# Altium project MB1115.PrjPCB
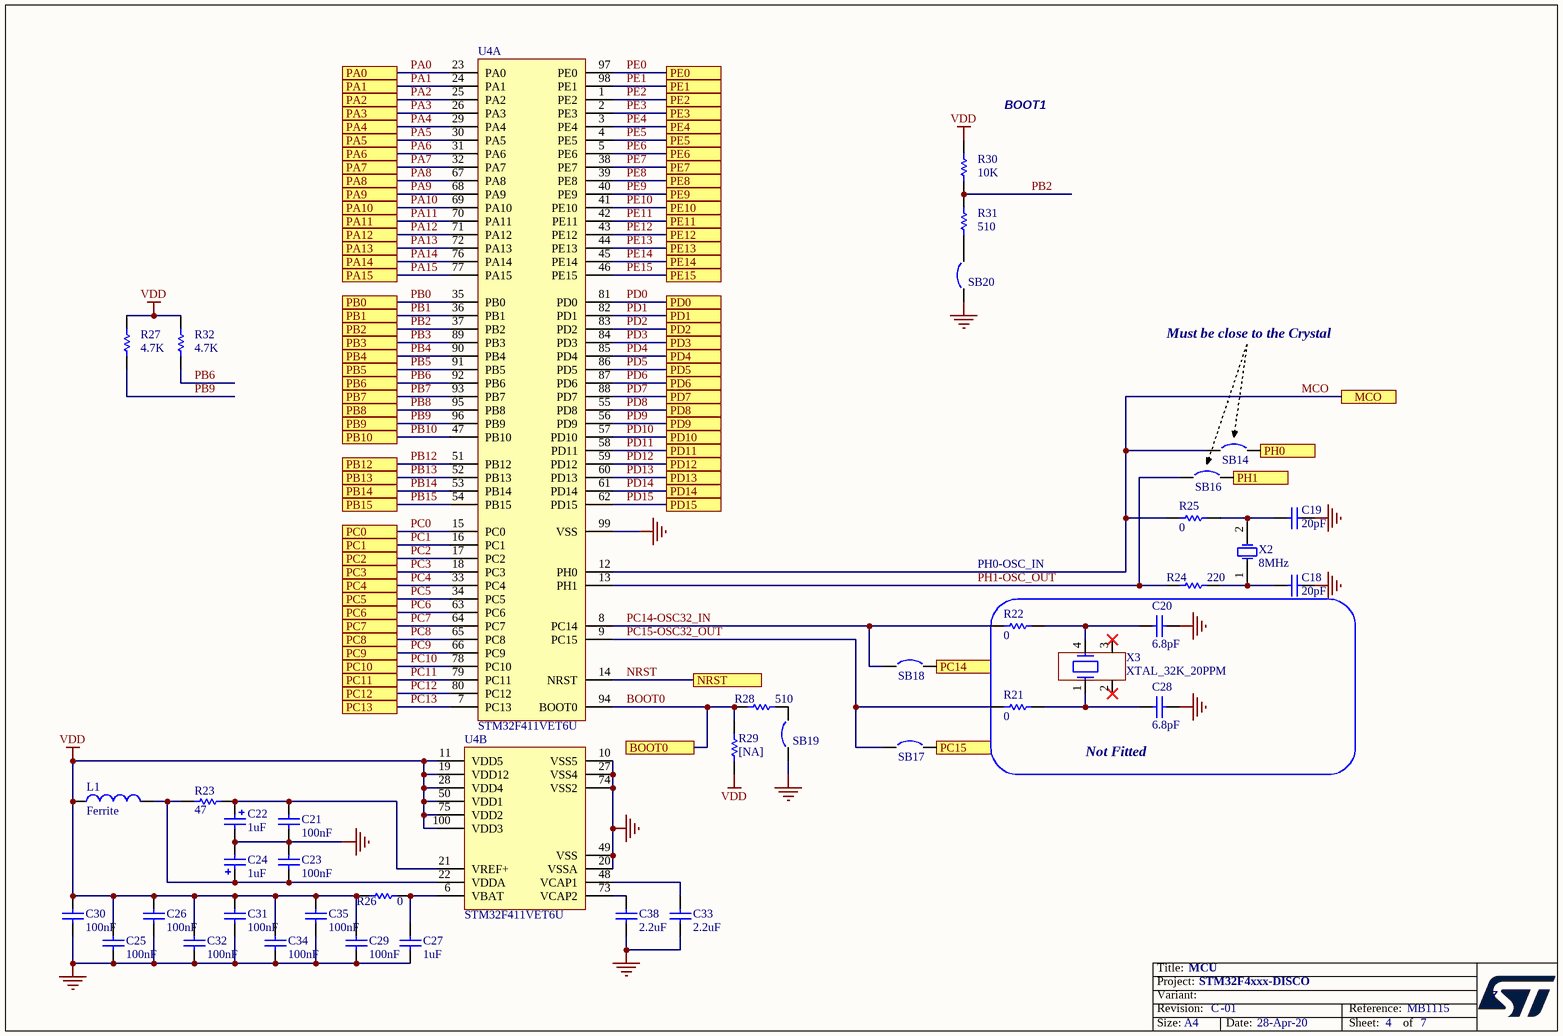
[diagram p0: STM32Fx.SchDoc]
Board_Reference: MB1115; Board_PCB_Revision: C; Board_Name: STM32F4xxx-DISCO; Board_Document_Date: 28-Apr-20; Board_Assembly_Revision: 01
1 sheet, 41 parts. Net scope: flat (ports and power ports of the same name join across sheets).
Board file: MB1115C.PcbDoc

## Sheet STM32Fx.SchDoc: MCU
size A4; DocumentNumber: 3; SheetNumber: 4; SheetTotal: 7

### Parts
C18  20pF  [0402C (Primary)]
C19  20pF  [0402C (Primary)]
C20  6.8pF  [0402C (Primary)]
C21  100nF  [0402C (Primary)]
C22  1uF  [TAN-A (Primary)]
C23  100nF  [0402C (Primary)]
C24  1uF  [TAN-A (Primary)]
C25  100nF  [0402C (Primary)]
C26  100nF  [0402C (Primary)]
C27  1uF  [0603C (Primary)]
C28  6.8pF  [0402C (Primary)]
C29  100nF  [0402C (Primary)]
C30  100nF  [0402C (Primary)]
C31  100nF  [0402C (Primary)]
C32  100nF  [0402C (Primary)]
C33  2.2uF  [TAN-A (Primary)]
C34  100nF  [0402C (Primary)]
C35  100nF  [0402C (Primary)]
C38  2.2uF  [TAN-A (Primary)]
L1  Ferrite  [0603L (Primary)]
R21  0  [0402R (Primary)]
R22  0  [0402R (Primary)]
R23  47  [0402R (Primary)]
R24  220  [0402R (Primary)]
R25  0  [0402R (Primary)]
R26  0  [0402R (Primary)]
R27  4.7K  [0402R (Primary)]
R28  510  [0402R (Primary)]
R29  [NA]  [0402R (Primary)]
R30  10K  [0402R (Primary)]
R31  510  [0402R (Primary)]
R32  4.7K  [0402R (Primary)]
SB14  Circuit Breaker  [JP2_SMD (Primary)]  (value not drawn)
SB16  Circuit Breaker  [JP2_SMD (Primary)]  (value not drawn)
SB17  Circuit Breaker  [JP2_SMD (Primary)]  (value not drawn)
SB18  Circuit Breaker  [JP2_SMD (Primary)]  (value not drawn)
SB19  Circuit Breaker  [JP2_SMD (Primary)]  (value not drawn)
SB20  Circuit Breaker  [JP2_SMD (Primary)]  (value not drawn)
U4  STM32F411VET6U  [TQFP100_14X14 (Primary)]  (parts A,B of 2)
X2  8MHz  [XTAL1 (Primary)]
X3  XTAL_32K_20PPM  [MC306-CRYSTAL (Primary)]

### Blocks framed on the sheet
Not Fitted: C20 C28 R21 R22 X3

### Ports
BOOT0, MCO, NRST, PA0, PA1, PA2, PA3, PA4, PA5, PA6, PA7, PA8, PA9, PA10, PA11, PA12, PA13, PA14, PA15, PB0, PB1, PB2, PB3, PB4, PB5, PB6, PB7, PB8, PB9, PB10, PB12, PB13, PB14, PB15, PC0, PC1, PC2, PC3, PC4, PC5, PC6, PC7, PC8, PC9, PC10, PC11, PC12, PC13, PC14, PC15, PD0, PD1, PD2, PD3, PD4, PD5, PD6, PD7, PD8, PD9, PD10, PD11, PD12, PD13, PD14, PD15, PE0, PE1, PE2, PE3, PE4, PE5, PE6, PE7, PE8, PE9, PE10, PE11, PE12, PE13, PE14, PE15, PH0, PH1

### Nets
GND: C18.1 C19.1 C20.2 C21.1 C22.2 C23.1 C24.2 C25.1 C26.2 C27.2 C28.2 C29.1 C30.1 C31.1 C32.1 C33.2 C34.1 C35.2 C38.2 SB19.1 SB20.1 U4.10(VSS5) U4.20(VSSA) U4.27(VSS4) U4.49(VSS) U4.74(VSS2) U4.99(VSS)
VDD: C25.2 C26.1 C29.2 C30.2 C31.2 C32.2 C34.2 C35.1 L1.1 R26.1 R27.1 R29.1 R30.1 R32.1 U4.11(VDD5) U4.19(VDD12) U4.28(VDD4) U4.50(VDD1) U4.75(VDD2) U4.100(VDD3)
BOOT0: R28.2 R29.2 U4.94(BOOT0) ; port BOOT0
MCO: R25.1 SB14.1 U4.12(PH0) ; port MCO
NRST: U4.14(NRST) ; port NRST
PA0: U4.23(PA0) ; port PA0
PA1: U4.24(PA1) ; port PA1
PA2: U4.25(PA2) ; port PA2
PA3: U4.26(PA3) ; port PA3
PA4: U4.29(PA4) ; port PA4
PA5: U4.30(PA5) ; port PA5
PA6: U4.31(PA6) ; port PA6
PA7: U4.32(PA7) ; port PA7
PA8: U4.67(PA8) ; port PA8
PA9: U4.68(PA9) ; port PA9
PA10: U4.69(PA10) ; port PA10
PA11: U4.70(PA11) ; port PA11
PA12: U4.71(PA12) ; port PA12
PA13: U4.72(PA13) ; port PA13
PA14: U4.76(PA14) ; port PA14
PA15: U4.77(PA15) ; port PA15
PB0: U4.35(PB0) ; port PB0
PB1: U4.36(PB1) ; port PB1
PB2: R30.2 R31.1 U4.37(PB2) ; port PB2
PB3: U4.89(PB3) ; port PB3
PB4: U4.90(PB4) ; port PB4
PB5: U4.91(PB5) ; port PB5
PB6: R32.2 U4.92(PB6) ; port PB6
PB7: U4.93(PB7) ; port PB7
PB8: U4.95(PB8) ; port PB8
PB9: R27.2 U4.96(PB9) ; port PB9
PB10: U4.47(PB10) ; port PB10
PB12: U4.51(PB12) ; port PB12
PB13: U4.52(PB13) ; port PB13
PB14: U4.53(PB14) ; port PB14
PB15: U4.54(PB15) ; port PB15
PC0: U4.15(PC0) ; port PC0
PC1: U4.16(PC1) ; port PC1
PC2: U4.17(PC2) ; port PC2
PC3: U4.18(PC3) ; port PC3
PC4: U4.33(PC4) ; port PC4
PC5: U4.34(PC5) ; port PC5
PC6: U4.63(PC6) ; port PC6
PC7: U4.64(PC7) ; port PC7
PC8: U4.65(PC8) ; port PC8
PC9: U4.66(PC9) ; port PC9
PC10: U4.78(PC10) ; port PC10
PC11: U4.79(PC11) ; port PC11
PC12: U4.80(PC12) ; port PC12
PC13: U4.7(PC13) ; port PC13
PC14-OSC32_IN: R22.1 SB18.1 U4.8(PC14)
PC15-OSC32_OUT: R21.1 SB17.1 U4.9(PC15)
PD0: U4.81(PD0) ; port PD0
PD1: U4.82(PD1) ; port PD1
PD2: U4.83(PD2) ; port PD2
PD3: U4.84(PD3) ; port PD3
PD4: U4.85(PD4) ; port PD4
PD5: U4.86(PD5) ; port PD5
PD6: U4.87(PD6) ; port PD6
PD7: U4.88(PD7) ; port PD7
PD8: U4.55(PD8) ; port PD8
PD9: U4.56(PD9) ; port PD9
PD10: U4.57(PD10) ; port PD10
PD11: U4.58(PD11) ; port PD11
PD12: U4.59(PD12) ; port PD12
PD13: U4.60(PD13) ; port PD13
PD14: U4.61(PD14) ; port PD14
PD15: U4.62(PD15) ; port PD15
PE0: U4.97(PE0) ; port PE0
PE1: U4.98(PE1) ; port PE1
PE2: U4.1(PE2) ; port PE2
PE3: U4.2(PE3) ; port PE3
PE4: U4.3(PE4) ; port PE4
PE5: U4.4(PE5) ; port PE5
PE6: U4.5(PE6) ; port PE6
PE7: U4.38(PE7) ; port PE7
PE8: U4.39(PE8) ; port PE8
PE9: U4.40(PE9) ; port PE9
PE10: U4.41(PE10) ; port PE10
PE11: U4.42(PE11) ; port PE11
PE12: U4.43(PE12) ; port PE12
PE13: U4.44(PE13) ; port PE13
PE14: U4.45(PE14) ; port PE14
PE15: U4.46(PE15) ; port PE15
PH1-OSC_OUT: R24.2 SB16.1 U4.13(PH1)
NetC18_2: C18.2 R24.1 X2.1(OSC1)
NetC19_2: C19.2 R25.2 X2.2(OSC2)
NetC20_1: C20.1 R22.2 X3.4
NetC21_2: C21.2 C22.1 R23.1 U4.21(VREF+)
NetC23_2: C23.2 C24.1 L1.2 R23.2 U4.22(VDDA)
NetC27_1: C27.1 R26.2 U4.6(VBAT)
NetC28_1: C28.1 R21.2 X3.1
NetC33_1: C33.1 U4.48(VCAP1)
NetC38_1: C38.1 U4.73(VCAP2)
NetR28_1: R28.1 SB19.2
NetR31_2: R31.2 SB20.2
NetSB14_2: SB14.2 ; port PH0
NetSB16_2: SB16.2 ; port PH1
NetSB17_2: SB17.2 ; port PC15
NetSB18_2: SB18.2 ; port PC14

Not connected (* = marked no-connect by the designer): X3 2* 3*

### Notes on the sheet
- BOOT1
- Must be close to the Crystal
- PH0-OSC_IN
- Title:
- Project:
- Size:
- Revision:
- Variant:
- A4
- -
- Date:
- Reference:
- Sheet:
- of

### Library data of the parts
C18 C19 = Cap_20pF_NPO_5%_0402: Capacitor,20pF,50V,NPO,5%,0402,YAGEO; Order: CC0402JRNPO9BN200; Revision: July-2002: Re-released for DXP Platform.; Value: 20pF; Manuf_1: YAGEO; Manuf_Part_1: CC0402JRNPO9BN200
C20 C28 = Cap_6.8pF_NPO_4%_0402: Capacitor,6.8pF,50V,NPO,4%,0402,AVX; Order: 04025A6R8CAT2A; Fitted: NO; Revision: July-2002: Re-released for DXP Platform.; Value: 6.8pF; Manuf_1: AVX; Manuf_Part_1: 04025A6R8CAT2A
C21 C23 C25 C26 C29-C32 C34 C35 = Cap_100nF_X7R_10%_0402: Capacitor,100nF,16V,X7R,10%,0402,YAGEO; Manuf_Part_1: CC0402KRX7R7BB104; Revision: July-2002: Re-released for DXP Platform.; Value: 100nF; Order: CC0402KRX7R7BB104; Manuf_1: YAGEO
C22 C24 = Cap_1uF_POL_10%_TANA: Polarized Capacitor,1uF,16V,10%,typeA,AVX; Manuf_Part_1: TAJA105K016R; Revision: July-2002: Re-released for DXP Platform.; Value: 1uF; Order: TAJA105K016R; Manuf_1: AVX; Distrib: *
C27 = Cap_1uF_X5R_10%_0603: Capacitor,1uF,16V,X5R,10%,0603,YAGEO; Manuf_Part_1: CC0603KRX5R7BB105; Revision: July-2002: Re-released for DXP Platform.; Value: 1uF; Order: CC0603KRX5R7BB105; Manuf_1: YAGEO
C33 C38 = Cap_2.2uF_X7R_10%_0805: Capacitor,2.2uF,16V, X7R,10%,0805,YAGEO; Manuf_Part_1: CC0805KKX7R7BB225; Revision: July-2002: Re-released for DXP Platform.; Value: 2.2uF; Order: CC0805KKX7R7BB225; Manuf_1: YAGEO
L1 = BEAD_600R_350MA_0603: Bead,600R,350mA,0603,FCM1608KF-601T03,Tai-tech; Manuf_2: TDK; Manuf_Part_2: MPZ1608S300A; Value: 100uH; Comment_1: bead,30R,5A,0603,MPZ1608S300A,TDK; Revision: July-2002: Re-released for DXP Platform.; Manuf_Part_1: FCM1608KF-601T03; Order: FCM1608KF-601T03; Manuf_1: Tai-tech
R21 R22 = Res_0_0402: Resistor,0,0402; Fitted: NO; Value: 0
R23 = Res1: Resistor; Value: 1K; Published: 8-Jun-2000; Revision: July-2002: Re-released for DXP Platform.; Publisher: Altium Limited
R24 R28 = Res1: Resistor; Published: 8-Jun-2000; Revision: July-2002: Re-released for DXP Platform.; Publisher: Altium Limited
  R24: Value: 220
  R28: Value: 510
R25 R26 = Res_0_0402: Resistor,0,0402; Value: 0
R27 R32 = res1: Resistor; Value: 10K; Published: 8-Jun-2000; Revision: July-2002: Re-released for DXP Platform.; Publisher: Altium Limited
R29 = Res_NA_0402: Resistor,[NA],0402; Fitted: NO; Value: [NA]
R30 R31 = res1: Resistor; Published: 8-Jun-2000; Revision: July-2002: Re-released for DXP Platform.; Publisher: Altium Limited
  R30: Value: 10K
  R31: Value: 510
SB14 SB16 SB20 = Circuit Breaker: Solder: NO; Revision: July-2002: Re-released for DXP Platform.
SB17-SB19 = Circuit Breaker: Solder: YES; Revision: July-2002: Re-released for DXP Platform.
U4 = STM32F401VCT6U: STM32 Tiny Manta (STM32F401VCT6U); Manuf_1: STM; Provided: ST; Ref St: 9175846; ECCN_US/EU: 3A991A2/NEC; Manuf_Part_1: STM32F401VCT6U; Distrib: ST; Footprint: QFP100
X2 = XTAL_8MHZ_20PPM: Crystal Oscillator,8Mhz,20PF,20PPM,-10-70 degree,DIP,HC-49S; Manuf_Part_1: HC-49S-C20QSA-8.000MHZ; Order: HC-49S-C20QSA-8.000MHZ
X3 = XTAL_32K: Crystal oscillator for clock,32.768K,6PF,20PPM,-40~85 degree,SMT; Manuf_Part_1: ETMB32.768W060BMPF; Comment_1: MC306-G-06Q-32.768; Fitted: NO; Order: ETMB32.768W060BMPF

## Assembly variants
F411VE: not fitted C20 C28 C36 C67 JP1 R2 R11 R21 R22 R29 R33 R46 R47 R55 R62 R66 SB2 SB4 SB6 SB8 SB10 SB11 SB12 SB14 SB16 SB20 X3